# Altium schematic sheet MAIN.SchDoc
size A4; SheetNumber: 1; SheetTotal: 7
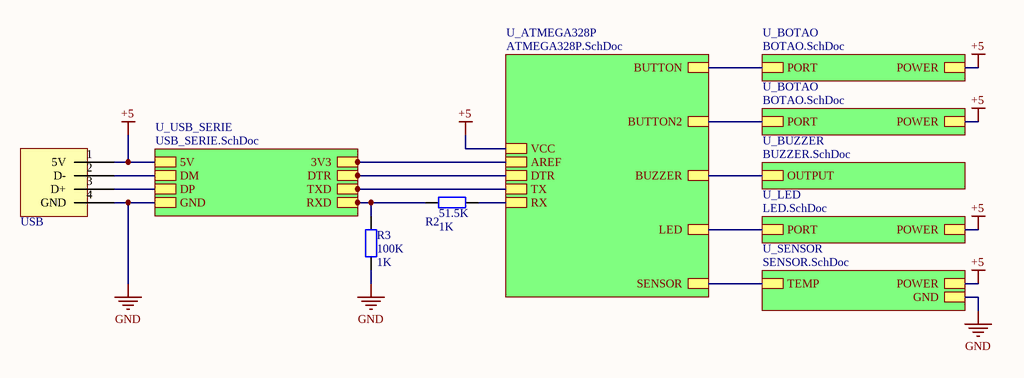
[diagram p0: MAIN.SchDoc]

## Parts
?  USB  [USB_Port_PCB]
R2  51.5K  value 1K  [AXIAL-0.4]
R3  100K  value 1K  [AXIAL-0.4]

## Sub-sheets
U_ATMEGA328P = ATMEGA328P.SchDoc: DTR, SENSOR, BUTTON, BUTTON2, AREF, LED, BUZZER, RX, TX, VCC
U_BOTAO = BOTAO.SchDoc: POWER, PORT
U_BOTAO = BOTAO.SchDoc: POWER, PORT
U_BUZZER = BUZZER.SchDoc: OUTPUT
U_LED = LED.SchDoc: PORT, POWER
U_SENSOR = SENSOR.SchDoc: POWER, TEMP, GND
U_USB_SERIE = USB_SERIE.SchDoc: GND, DP, DM, 5V, TXD, DTR, RXD, 3V3

## Nets
+5: ?.1(5V) ; sheet U_ATMEGA328P/VCC, sheet U_BOTAO/POWER, sheet U_LED/POWER, sheet U_SENSOR/POWER, sheet U_BOTAO/POWER, sheet U_USB_SERIE/5V
GND: ?.4(GND) R3.1 ; sheet U_SENSOR/GND, sheet U_USB_SERIE/GND
Net?_2: ?.2(D-) ; sheet U_USB_SERIE/DM
Net?_3: ?.3(D+) ; sheet U_USB_SERIE/DP
NetR2_1: R2.1 R3.2 ; sheet U_USB_SERIE/RXD
NetR2_2: R2.2 ; sheet U_ATMEGA328P/RX
(unnamed): sheet U_ATMEGA328P/DTR, sheet U_USB_SERIE/DTR
(unnamed): sheet U_ATMEGA328P/SENSOR, sheet U_SENSOR/TEMP
(unnamed): sheet U_ATMEGA328P/BUTTON, sheet U_BOTAO/PORT
(unnamed): sheet U_ATMEGA328P/BUTTON2, sheet U_BOTAO/PORT
(unnamed): sheet U_ATMEGA328P/AREF, sheet U_USB_SERIE/3V3
(unnamed): sheet U_ATMEGA328P/LED, sheet U_LED/PORT
(unnamed): sheet U_ATMEGA328P/BUZZER, sheet U_BUZZER/OUTPUT
(unnamed): sheet U_ATMEGA328P/TX, sheet U_USB_SERIE/TXD

## Library data of the parts
R2 R3 = Res2: Resistor; Published: 8-Jun-2000; LatestRevisionDate: 17-Jul-2002; LatestRevisionNote: Re-released for DXP Platform.; PackageReference: AXIAL-0.4; Publisher: Altium Limited; PackageDescription: Axial Device, Thru-Hole; 2 Leads; 0.4 in Pin Spacing